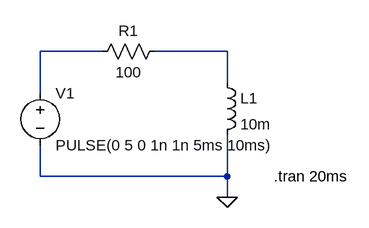
[diagram p0: schematic RL_Circuit.asc]
RL_Circuit.asc, the LTspice schematic file:
Version 4.1
SHEET 1 880 680
WIRE 80 64 -16 64
WIRE 272 64 160 64
WIRE 272 112 272 64
WIRE -16 128 -16 64
WIRE -16 256 -16 208
WIRE 272 256 272 192
WIRE 272 256 -16 256
WIRE 272 288 272 256
FLAG 272 288 0
SYMBOL voltage -16 112 R0
WINDOW 123 0 0 Left 0
WINDOW 39 0 0 Left 0
SYMATTR InstName V1
SYMATTR Value PULSE(0 5 0 1n 1n 5ms 10ms)
SYMBOL res 176 48 R90
WINDOW 0 0 56 VBottom 2
WINDOW 3 32 56 VTop 2
SYMATTR InstName R1
SYMATTR Value 100
SYMBOL ind 256 96 R0
SYMATTR InstName L1
SYMATTR Value 10m
TEXT 344 256 Left 2 !.tran 20ms

The netlist it stands for:
* RL_Circuit.asc
V1 N001 0 PULSE(0 5 0 1n 1n 5ms 10ms)
R1 N002 N001 100
L1 N002 0 10m
.tran 20ms
.backanno
.end